# Altium schematic sheet 08.SchDoc
size 420 x 297 mm
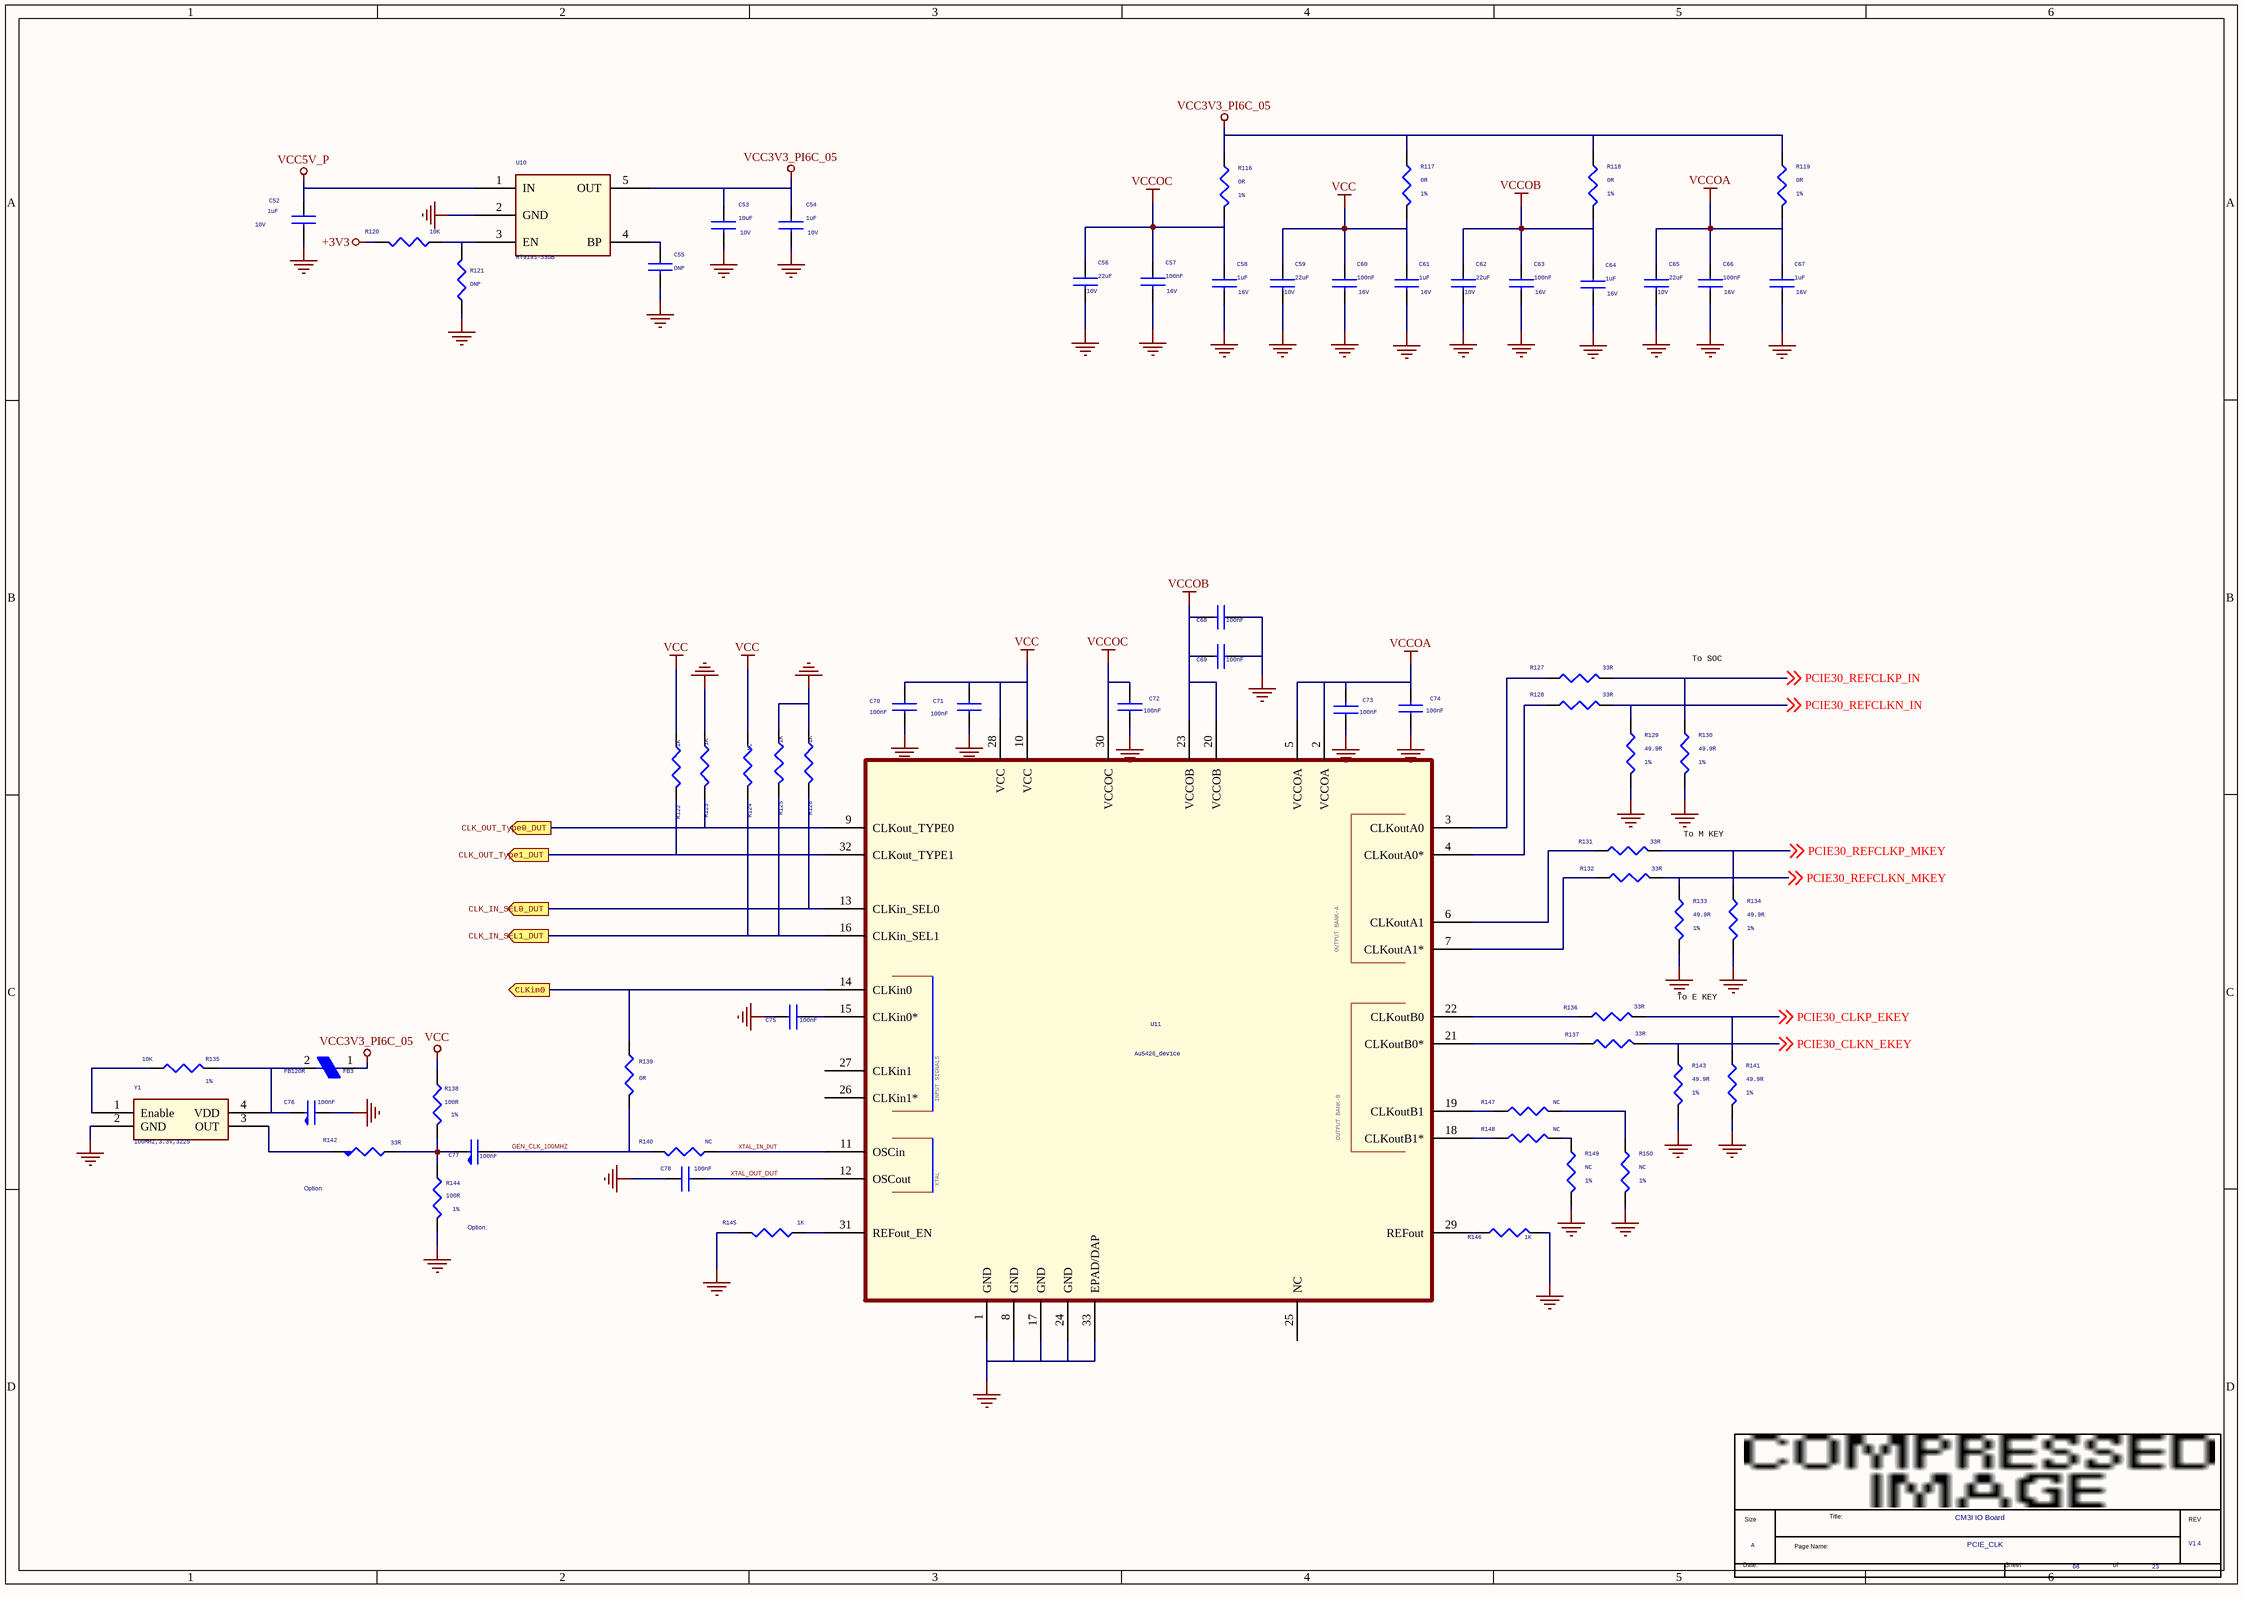
[diagram p0: 08.SchDoc]

## Parts
*  Page Count: 23  Page Number: 08  Page Size: A  Title: CM3I IO Board  RevCode: V1.4  Doc: PCIE_CLK  (hidden comment: radxa_1010)  (graphical)
C52  1uF  Voltage: 10V  [C0402]
C53  10uF  Voltage: 10V  [C0603]
C54  1uF  Voltage: 10V  [C0402]
C55  DNP  [C0402]
C56  22uF  Voltage: 10V  [C0603]
C57  100nF  Voltage: 16V  [C0402]
C58  1uF  Voltage: 16V  [C0402]
C59  22uF  Voltage: 10V  [C0603]
C60  100nF  Voltage: 16V  [C0402]
C61  1uF  Voltage: 16V  [C0402]
C62  22uF  Voltage: 10V  [C0603]
C63  100nF  Voltage: 16V  [C0402]
C64  1uF  Voltage: 16V  [C0402]
C65  22uF  Voltage: 10V  [C0603]
C66  100nF  Voltage: 16V  [C0402]
C67  1uF  Voltage: 16V  [C0402]
C68  100nF  [C0402]
C69  100nF  [C0402]
C70  100nF  [C0402]
C71  100nF  [C0402]
C72  100nF  [C0402]
C73  100nF  [C0402]
C74  100nF  [C0402]
C75  100nF  [C0402]
C76  100nF  [C0402]
C77  100nF  [C0402]
C78  100nF  [C0402]
FB3  FB120R  [R0402]
R116  0R  Tolerance: 1%  [R0402]
R117  0R  Tolerance: 1%  [R0402]
R118  0R  Tolerance: 1%  [R0402]
R119  0R  Tolerance: 1%  [R0402]
R120  10K  [R0402]
R121  DNP  [R0402]
R122  1K  [R0402]
R123  1K  [R0402]
R124  NC  [R0402]
R125  1K  [R0402]
R126  1K  [R0402]
R127  33R  [R0402]
R128  33R  [R0402]
R129  49.9R  Tolerance: 1%  [R0402]
R130  49.9R  Tolerance: 1%  [R0402]
R131  33R  [R0402]
R132  33R  [R0402]
R133  49.9R  Tolerance: 1%  [R0402]
R134  49.9R  Tolerance: 1%  [R0402]
R135  10K  Tolerance: 1%  [R0402]
R136  33R  [R0402]
R137  33R  [R0402]
R138  100R  Tolerance: 1%  [R0402]
R139  0R  [R0402]
R140  NC  [R0402]
R141  49.9R  Tolerance: 1%  [R0402]
R142  33R  [R0402]
R143  49.9R  Tolerance: 1%  [R0402]
R144  100R  Tolerance: 1%  [R0402]
R145  1K  [R0402]
R146  1K  [R0402]
R147  NC  [R0402]
R148  NC  [R0402]
R149  NC  Tolerance: 1%  [R0402]
R150  NC  Tolerance: 1%  [R0402]
U10  RT9193-33GB  [SOT_23_5]
U11  Au5426_device  [QFN50P500X500X90-33N]
Y1  100MHz,3.3V,3225  [Y-4-5_08-TXC-7W5]

## Ports
CLK_IN_SEL0_DUT (out), CLK_IN_SEL1_DUT (out), CLK_OUT_Type0_DUT (out), CLK_OUT_Type1_DUT (out), CLKin0 (out)

## Nets
+3V3: R120.1
GND: C52.2 C53.2 C54.2 C55.2 C56.2 C57.2 C58.2 C59.2 C60.2 C61.2 C62.2 C63.2 C64.2 C65.2 C66.2 C67.2 C68.1 C69.1 C70.1 C71.1 C72.1 C73.1 C74.1 C75.1 C76.2 C78.1 R121.2 R123.1 R125.1 R126.1 R129.2 R130.2 R133.2 R134.2 R141.2 R143.2 R144.2 R145.2 R146.1 R149.2 R150.2 U10.2(GND) U11.1(GND) U11.8(GND) U11.17(GND) U11.24(GND) U11.33(EPAD/DAP) Y1.2(GND)
VCC: C59.1 C60.1 C61.1 C70.2 C71.2 R117.2 R122.1 R124.1 R138.1 U11.10(VCC) U11.28(VCC)
VCC3V3_PI6C_05: C53.1 C54.1 FB3.1 R116.1 R117.1 R118.1 R119.1 U10.5(OUT)
VCC5V_P: C52.1 U10.1(IN)
VCCOA: C65.1 C66.1 C67.1 C73.2 C74.2 R119.2 U11.2(VCCOA) U11.5(VCCOA)
VCCOB: C62.1 C63.1 C64.1 C68.2 C69.2 R118.2 U11.20(VCCOB) U11.23(VCCOB)
VCCOC: C56.1 C57.1 C58.1 C72.2 R116.2 U11.30(VCCOC)
CLK_IN_SEL0_DUT: R126.2 U11.13(CLKin_SEL0) ; port CLK_IN_SEL0_DUT
CLK_IN_SEL1_DUT: R124.2 R125.2 U11.16(CLKin_SEL1) ; port CLK_IN_SEL1_DUT
CLK_OUT_Type0_DUT: R123.2 U11.9(CLKout_TYPE0) ; port CLK_OUT_Type0_DUT
CLK_OUT_Type1_DUT: R122.2 U11.32(CLKout_TYPE1) ; port CLK_OUT_Type1_DUT
CLKin0: R139.1 U11.14(CLKin0) ; port CLKin0
GEN_CLK_100MHZ: C77.2 R139.2 R140.2
PCIE30_CLKN_EKEY: R137.2 R143.1 ; off-sheet PCIE30_CLKN_EKEY
PCIE30_CLKP_EKEY: R136.2 R141.1 ; off-sheet PCIE30_CLKP_EKEY
PCIE30_REFCLKN_IN: R128.2 R129.1 ; off-sheet PCIE30_REFCLKN_IN
PCIE30_REFCLKN_MKEY: R132.2 R133.1 ; off-sheet PCIE30_REFCLKN_MKEY
PCIE30_REFCLKP_IN: R127.2 R130.1 ; off-sheet PCIE30_REFCLKP_IN
PCIE30_REFCLKP_MKEY: R131.2 R134.1 ; off-sheet PCIE30_REFCLKP_MKEY
XTAL_IN_DUT: R140.1 U11.11(OSCin)
XTAL_OUT_DUT: C78.2 U11.12(OSCout)
NetC55_1: C55.1 U10.4(BP)
NetC75_2: C75.2 U11.15(CLKin0*)
NetC76_1: C76.1 FB3.2 R135.1 Y1.4(VDD)
NetC77_1: C77.1 R138.2 R142.2 R144.1
NetR120_2: R120.2 R121.1 U10.3(EN)
NetR127_1: R127.1 U11.3(CLKoutA0)
NetR128_1: R128.1 U11.4(CLKoutA0*)
NetR131_1: R131.1 U11.6(CLKoutA1)
NetR132_1: R132.1 U11.7(CLKoutA1*)
NetR135_2: R135.2 Y1.1(Enable)
NetR136_1: R136.1 U11.22(CLKoutB0)
NetR137_1: R137.1 U11.21(CLKoutB0*)
NetR142_1: R142.1 Y1.3(OUT)
NetR145_1: R145.1 U11.31(REFout_EN)
NetR146_2: R146.2 U11.29(REFout)
NetR147_1: R147.1 U11.19(CLKoutB1)
NetR147_2: R147.2 R150.1
NetR148_1: R148.1 U11.18(CLKoutB1*)
NetR148_2: R148.2 R149.1

Not connected (* = marked no-connect by the designer): U11 25(NC) 26(CLKin1*) 27(CLKin1)

## Notes on the sheet
- To SOC
- To M KEY
- To E KEY
- (in symbol Au5426_device) OUTPUT BANK-A; INPUT SIGNALS; OUTPUT BANK-B; XTAL
- (in symbol radxa_1010) Size; Title:; REV; Page Name:; Date:; Sheet; of

## Library data of the parts
C52 = CAP NP_0: cap,1.00uF,+/-10%,10V,X5R,C0402; Manufacturer: TDK; RK PN: C1005X5R1A105K050BB; Priority: A; Tolerance: 10%; Dielectric: X5R; Part Type: C0402; Manufacturer PN: C1005X5R1A105K050BB; Created by: JJJ
C53 = CAP NP_0: cap,10.00uF,+/-10%,10V,X5R,C0603; Manufacturer PN: C1608X5R1A106K080AC; Manufacturer: TDK; Tolerance: 10%; Priority: A; Dielectric: X5R; Created by: JJJ; Part Type: C0603; RK PN: C1608X5R1A106K080AC
C54 = CAP NP_0: cap,1.00uF,+/-10%,10V,X5R,C0402; Manufacturer PN: C1005X5R1A105K050BB; Manufacturer: TDK; Tolerance: 10%; Priority: A; Dielectric: X5R; Created by: JJJ; Part Type: C0402; RK PN: C1005X5R1A105K050BB
C55 = CAP NP_0: Did Not Place.; RK PN: DNPC0402; Priority: A; Part Type: DNP; Manufacturer PN: DNPC0402; Created by: JJJ
C56 C65 = CAP NP_0: cap,22.00uF,+/-20%,10V,X5R,C0603; Manufacturer PN: C1608X5R1A226M080AC; Manufacturer: TDK; Tolerance: 20%; C_Voltage: 6.3V; Priority: A; Dielectric: X5R; Created by: JJJ; Part Type: C0603; RK PN: C1608X5R1A226M080AC
C57 C58 C61 C63 C66 = CAP NP_0: cap,100.00nF,+/-10%,16V,X5R,C0402; Manufacturer: TDK; Number: 37; RK PN: C1005X5R1C104K050BA; Priority: A; Tolerance: 10%; C_Voltage: 6.3V; Dielectric: X5R; Part Type: C0402; Manufacturer PN: C1005X5R1C104K050BA; Created by: JJJ
C59 C62 = CAP NP_0: cap,22.00uF,+/-20%,10V,X5R,C0603; Manufacturer: TDK; RK PN: C1608X5R1A226M080AC; Priority: A; C_Voltage: 6.3V; Tolerance: 20%; Dielectric: X5R; Part Type: C0603; Manufacturer PN: C1608X5R1A226M080AC; Created by: JJJ
C60 C64 C67 = CAP NP_0: cap,100.00nF,+/-10%,16V,X5R,C0402; Manufacturer PN: C1005X5R1C104K050BA; Manufacturer: TDK; C_Voltage: 6.3V; Tolerance: 10%; Priority: A; Number: 37; Dielectric: X5R; Created by: JJJ; Part Type: C0402; RK PN: C1005X5R1C104K050BA
C68 C70 C73 = CAP NP_Dup1: ManufacturerPN: GCM155R71C104KA55D; Manufacturer: Murata Electronics North America
C69 C71 C72 C74 = CAP NP_Dup1: Manufacturer: Murata Electronics North America; ManufacturerPN: GCM155R71C104KA55D
C75 C78 = CAP NP_Dup1: Manufacturer: Murata Electronics; ManufacturerPN: GCM1555C1H270FA16D; mounting_status: DNP
C76 = CAP NP: 0.1uF,10%,16V,X7R,0402,SMD,YAGEO,CC0402KRX7R7BB104; TGXA Part Num: 1100.000062; Part: 0.1uF_16V_X7R; SIGNAL_MODEL: CAP_NP_C0402_0.1UF_16V_X7R_0.1uF_16V_X7R; Vendor Code: CC0402KRX7R7BB104; Manufacturer: YAGEO; PN: 1100.000062
C77 = CAP NP: 0.1uF,10%,16V,X7R,0402,SMD,YAGEO,CC0402KRX7R7BB104; Part: 0.1uF_16V_X7R; PN: 1100.000062; SIGNAL_MODEL: CAP_NP_C0402_0.1UF_16V_X7R_0.1uF_16V_X7R; Manufacturer: YAGEO; Vendor Code: CC0402KRX7R7BB104; TGXA Part Num: 1100.000062
FB3 = FERRITE BEAD: 贴片磁珠,茂昌,MCCB1608RL120HC060,120R,25%,0.6A,DCR 0.25R,0603,SMD,H0.8mm,-55~125℃ /; TGXA Part Num: 1202.000003; Part: 120R_100MHZ_0.6A; Manufacturer: 茂昌; Vendor Code: MCCB1608RL120HC060; PN: 1202.000003
R116-R119 = RESISTOR_0_Dup1: 通用厚膜电阻,470R,+/-1%,R0402,1/16W.; Manufacturer: YAGEO; RK PN: RC0402FR-07470RL; Priority: A; Wattage: 1/16W; Part Type: 通用厚膜电阻; Manufacturer PN: RC0402FR-07470RL; Created by: YTL
R120 = RESISTOR_0_Dup1: 通用厚膜电阻,10K,+/-5%,R0402,1/16W.; Manufacturer PN: RC0402JR-0710KL; Manufacturer: YAGEO; Tolerance: 5%; Wattage: 1/16W; Priority: A; Created by: YTL; Part Type: 通用厚膜电阻; RK PN: RC0402JR-0710KL
R121 = RESISTOR_0_Dup1: Did Not Place.; RK PN: DNPR0402; Priority: A; Part Type: DNP; Manufacturer PN: DNPR0402; Created by: JJJ
R122-R125 R140 = RESISTOR_Dup1: ManufacturerPN: ERJ-2GE0R00X; Manufacturer: Panasonic
R126 R139 R145 R146 = RESISTOR_Dup1: Manufacturer: Panasonic; ManufacturerPN: ERJ-2GE0R00X
R127 R128 R131 R136 R137 = RESISTOR_0_Dup1: 通用厚膜电阻,33R,+/-5%,R0201,1/20W.; Manufacturer: YAGEO; Tolerance: 5%; RK PN: RC0201JR-0733RL; Priority: A; Wattage: 1/20W; Part Type: 通用厚膜电阻; Manufacturer PN: RC0201JR-0733RL; Created by: YTL
R129 R130 R141 R143 = RESISTOR_0_Dup1: 通用厚膜电阻,49R9,+/-1%,R0201,1/20W.; Manufacturer PN: RC0201FR-0749R9L; Manufacturer: YAGEO; Wattage: 1/20W; Priority: A; Created by: YTL; Part Type: 通用厚膜电阻; RK PN: RC0201FR-0749R9L
R132 = RESISTOR_0_Dup1: 通用厚膜电阻,33R,+/-5%,R0201,1/20W.; Manufacturer PN: RC0201JR-0733RL; Manufacturer: YAGEO; Tolerance: 5%; Wattage: 1/20W; Priority: A; Created by: YTL; Part Type: 通用厚膜电阻; RK PN: RC0201JR-0733RL
R133 R134 R149 R150 = RESISTOR_0_Dup1: 通用厚膜电阻,49R9,+/-1%,R0201,1/20W.; Manufacturer: YAGEO; RK PN: RC0201FR-0749R9L; Priority: A; Wattage: 1/20W; Part Type: 通用厚膜电阻; Manufacturer PN: RC0201FR-0749R9L; Created by: YTL
R135 R138 R144 = RESISTOR_0_Dup1: 通用厚膜电阻,0R,+/-5%,R0402,1/16W.; Manufacturer PN: RC0402JR-070RL; Manufacturer: YAGEO; Wattage: 1/16W; Priority: A; Created by: YTL; Part Type: 通用厚膜电阻; RK PN: RC0402JR-070RL
R142 = R_4: 33R,5%,1/16W,0402,SMD,YAGEO,RC0402JR-0733RL; TGXA Part Num: 1000.000017; Part: 33_J; Manufacturer: YAGEO; Vendor Code: RC0402JR-0733RL; PN: 1000.000017
R147 R148 = RESISTOR_0_Dup1: 通用厚膜电阻,33R,+/-5%,R0201,1/20W.; Manufacturer PN: RC0201JR-0733RL; Manufacturer: YAGEO; Tolerance: 5%; Wattage: 1/20W; Priority: A; OPTION: DNP; Created by: YTL; Part Type: 通用厚膜电阻; RK PN: RC0201JR-0733RL
U10 = LDO_PT5108: 3.3V Output,300mA, Low Dropout, Low Noise Ultra-Fast Without Bypass Capacitor CMOS LDO Regulator; Manufacturer: Richtek（立錡）; Priority: A; Created by: JJJ; Manufacturer PN: RT9193-33GB; Part Type: LDO; RK PN: RT9193-33GB
U11 = Au5426_device: ManufacturerPN: Au5246; Manufacturer: AURA; mounting_status: DNP
Y1 = 7W50000024_4: 有源晶振,YXC,O3225100MEDH4MI,100MHz,3.3V,LVCMOS,20ppm,3225,SMD; TGXA Part Num: 1601.000008; PN: 1601.000031; Vendor Code: 8E100000018V; Part: 100MHz,3.3V,3225; Manufacturer: YXC
* = radxa_1010: Page Create Date: March  8, 1995